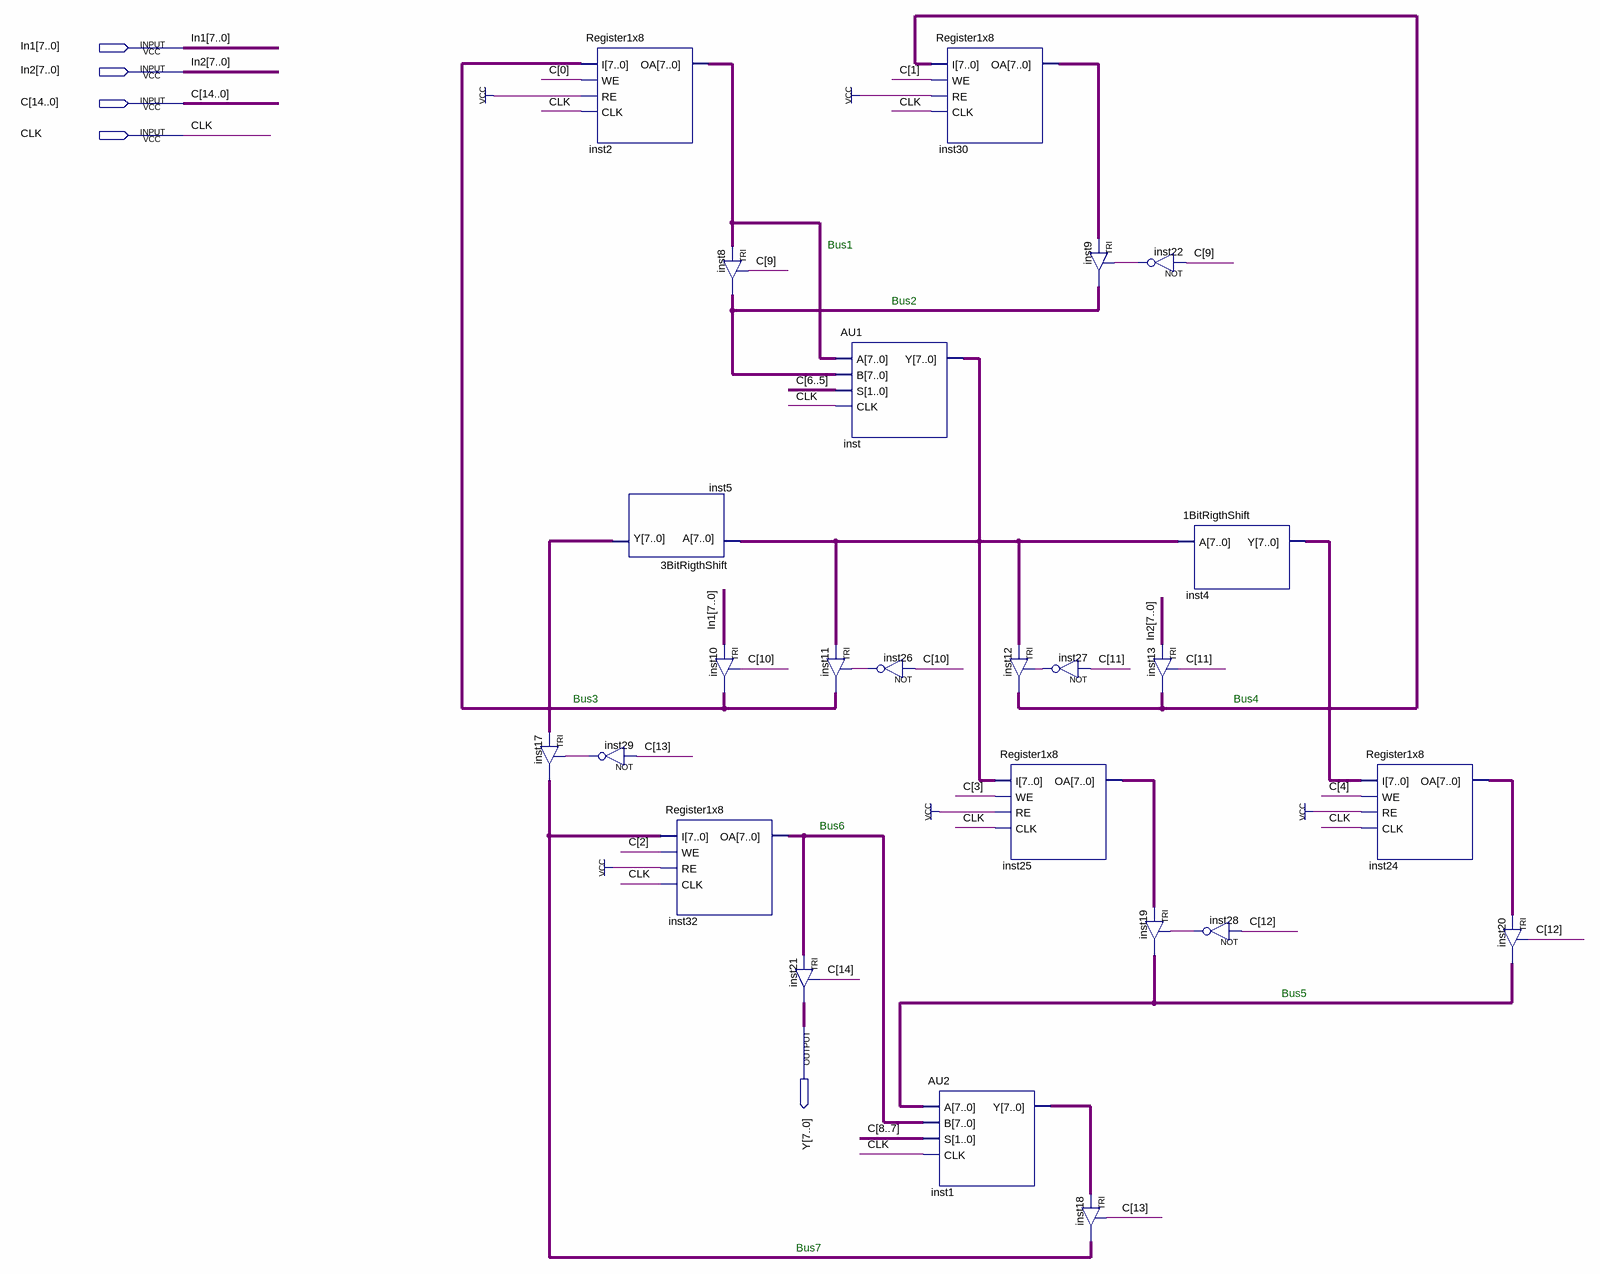
[diagram p0: schematic sheet]
// Quartus schematic Datapath2.bdf as structural Verilog: 25 symbols, 5 pins
module Datapath2 (
  input  [7:0] In1,
  input  [7:0] In2,
  input  [14:0] C,
  input  CLK,
  output [7:0] Y
);

  wire inst22_out, inst26_out, inst27_out, inst28_out, inst29_out;
  wire [7:0] inst1_y, inst2_oa, inst4_y, inst5_y, inst8_out, inst10_out, inst12_out, inst17_out, inst19_out,
       inst24_oa, inst25_oa, inst30_oa, inst32_oa, inst_y;

  Register1x8 inst2 (.I(inst10_out), .WE(C[0]), .RE(1'b1), .CLK(CLK), .OA(inst2_oa));
  TRI inst17[7:0] (.IN(inst5_y), .OE(inst29_out), .OUT(inst17_out));
  not inst29 (inst29_out, C[13]);
  \3BitRigthShift  inst5 (.A(inst_y), .Y(inst5_y));
  TRI inst8[7:0] (.IN(inst2_oa), .OE(C[9]), .OUT(inst8_out));
  TRI inst10[7:0] (.IN(In1), .OE(C[10]), .OUT(inst10_out));
  Register1x8 inst32 (.I(inst17_out), .WE(C[2]), .RE(1'b1), .CLK(CLK), .OA(inst32_oa));
  AU1 inst (.A(inst2_oa), .B(inst8_out), .S(C[6:5]), .CLK(CLK), .Y(inst_y));
  TRI inst11[7:0] (.IN(inst_y), .OE(inst26_out), .OUT(inst10_out));
  TRI inst21[7:0] (.IN(inst32_oa), .OE(C[14]), .OUT(Y));
  not inst26 (inst26_out, C[10]);
  Register1x8 inst30 (.I(inst12_out), .WE(C[1]), .RE(1'b1), .CLK(CLK), .OA(inst30_oa));
  AU2 inst1 (.A(inst19_out), .B(inst32_oa), .S(C[8:7]), .CLK(CLK), .Y(inst1_y));
  TRI inst12[7:0] (.IN(inst_y), .OE(inst27_out), .OUT(inst12_out));
  Register1x8 inst25 (.I(inst_y), .WE(C[3]), .RE(1'b1), .CLK(CLK), .OA(inst25_oa));
  TRI inst9[7:0] (.IN(inst30_oa), .OE(inst22_out), .OUT(inst8_out));
  not inst27 (inst27_out, C[11]);
  TRI inst18[7:0] (.IN(inst1_y), .OE(C[13]), .OUT(inst17_out));
  not inst22 (inst22_out, C[9]);
  TRI inst13[7:0] (.IN(In2), .OE(C[11]), .OUT(inst12_out));
  TRI inst19[7:0] (.IN(inst25_oa), .OE(inst28_out), .OUT(inst19_out));
  \1BitRigthShift  inst4 (.A(inst_y), .Y(inst4_y));
  not inst28 (inst28_out, C[12]);
  Register1x8 inst24 (.I(inst4_y), .WE(C[4]), .RE(1'b1), .CLK(CLK), .OA(inst24_oa));
  TRI inst20[7:0] (.IN(inst24_oa), .OE(C[12]), .OUT(inst19_out));

  // Notes on the sheet:
  //   Bus1
  //   Bus2
  //   Bus3
  //   Bus4
  //   Bus6
  //   Bus5
  //   Bus7
endmodule
